# EAGLE design Backplane (EAGLE 9.6.2)
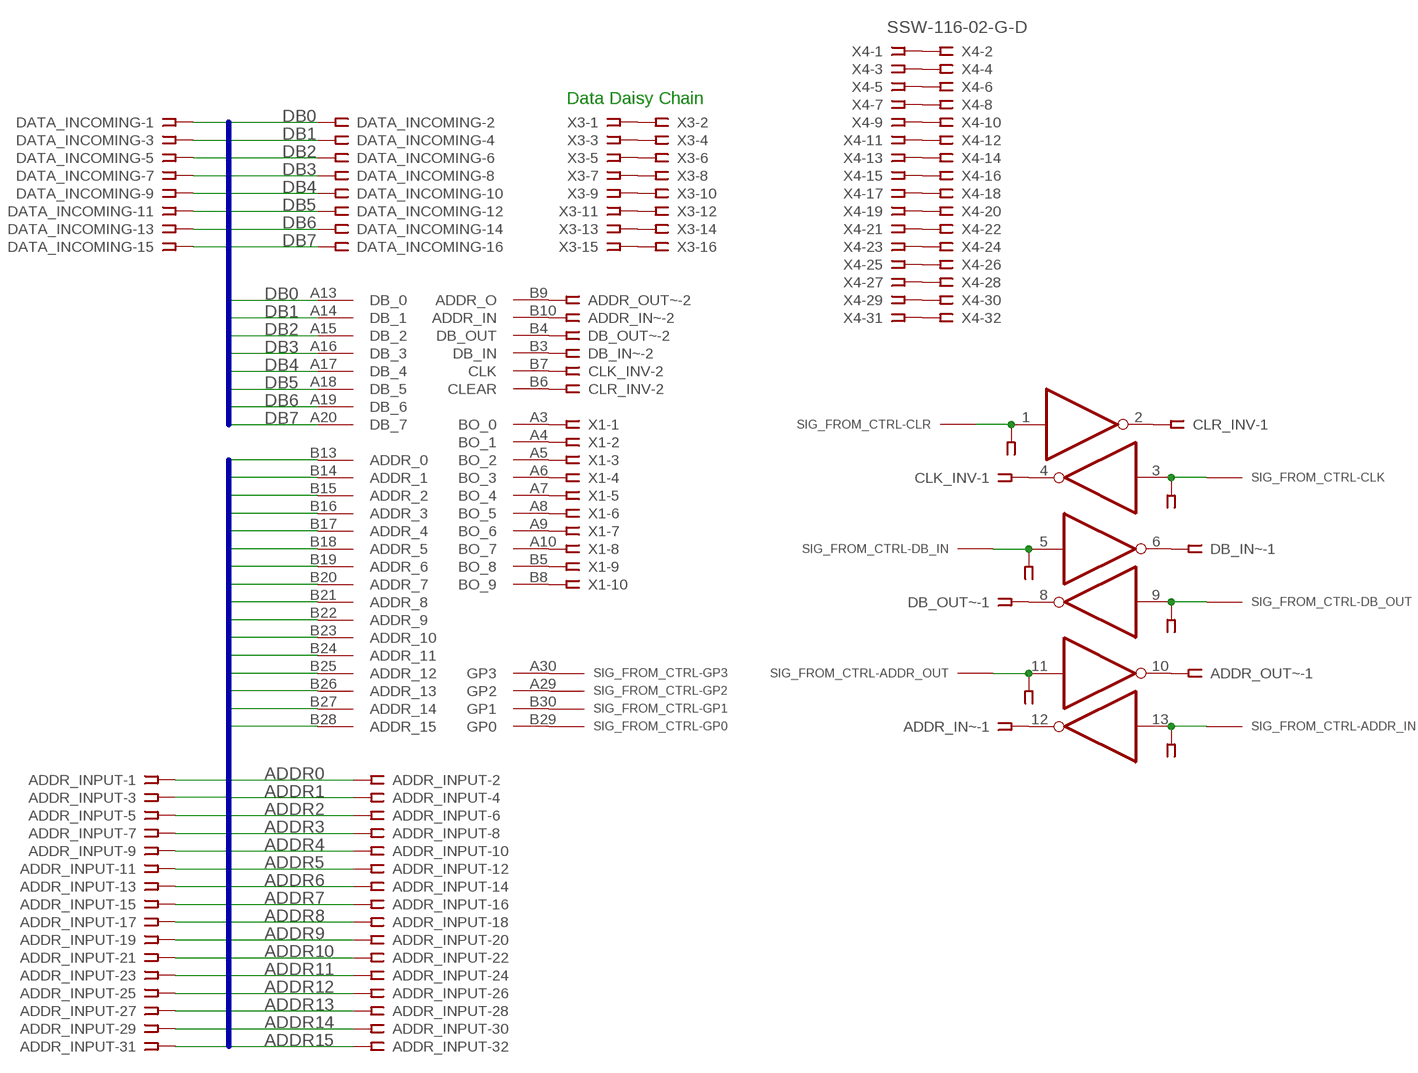
[diagram p0: schematic, sheet 1]

## Parts
ADDR_INPUT  SSW-116-02-G-D  [SSW-116-02-G-D]
ADDR_IN~  SSW-103-02-G-S  [SSW-103-02-G-S]
ADDR_OUT~  SSW-103-02-G-S  [SSW-103-02-G-S]
CLK_INV  SSW-103-02-G-S  [SSW-103-02-G-S]
CLR_INV  SSW-103-02-G-S  [SSW-103-02-G-S]
DATA_INCOMING  SSW-108-02-G-D  [SSW-108-02-G-D]
DB_IN~  SSW-103-02-G-S  [SSW-103-02-G-S]
DB_OUT~  SSW-103-02-G-S  [SSW-103-02-G-S]
IC1  74AC04N  [DIL14]
SIG_FROM_CTRL-  CONTROL_SIG-INT  [CONTROL_SIG-INT-FOOT]
U$2  BACKPLATE_INTERFACEHEADER  [PCI_INTERFACE]
X1  SSW-105-02-G-D  [SSW-105-02-G-D]
X3  SSW-108-02-G-D  [SSW-108-02-G-D]
X4  SSW-116-02-G-D  [SSW-116-02-G-D]

## Nets
ADDR0: ADDR_INPUT.1 ADDR_INPUT.2 U$2.B13(ADDR_0)
ADDR1: ADDR_INPUT.3 ADDR_INPUT.4 U$2.B14(ADDR_1)
ADDR2: ADDR_INPUT.5 ADDR_INPUT.6 U$2.B15(ADDR_2)
ADDR3: ADDR_INPUT.7 ADDR_INPUT.8 U$2.B16(ADDR_3)
ADDR4: ADDR_INPUT.9 ADDR_INPUT.10 U$2.B17(ADDR_4)
ADDR5: ADDR_INPUT.11 ADDR_INPUT.12 U$2.B18(ADDR_5)
ADDR6: ADDR_INPUT.13 ADDR_INPUT.14 U$2.B19(ADDR_6)
ADDR7: ADDR_INPUT.15 ADDR_INPUT.16 U$2.B20(ADDR_7)
ADDR8: ADDR_INPUT.17 ADDR_INPUT.18 U$2.B21(ADDR_8)
ADDR9: ADDR_INPUT.19 ADDR_INPUT.20 U$2.B22(ADDR_9)
ADDR10: ADDR_INPUT.21 ADDR_INPUT.22 U$2.B23(ADDR_10)
ADDR11: ADDR_INPUT.23 ADDR_INPUT.24 U$2.B24(ADDR_11)
ADDR12: ADDR_INPUT.25 ADDR_INPUT.26 U$2.B25(ADDR_12)
ADDR13: ADDR_INPUT.27 ADDR_INPUT.28 U$2.B26(ADDR_13)
ADDR14: ADDR_INPUT.29 ADDR_INPUT.30 U$2.B27(ADDR_14)
ADDR15: ADDR_INPUT.31 ADDR_INPUT.32 U$2.B28(ADDR_15)
DB0: DATA_INCOMING.1 DATA_INCOMING.2 U$2.A13(DB_0)
DB1: DATA_INCOMING.3 DATA_INCOMING.4 U$2.A14(DB_1)
DB2: DATA_INCOMING.5 DATA_INCOMING.6 U$2.A15(DB_2)
DB3: DATA_INCOMING.7 DATA_INCOMING.8 U$2.A16(DB_3)
DB4: DATA_INCOMING.9 DATA_INCOMING.10 U$2.A17(DB_4)
DB5: DATA_INCOMING.11 DATA_INCOMING.12 U$2.A18(DB_5)
DB6: DATA_INCOMING.13 DATA_INCOMING.14 U$2.A19(DB_6)
DB7: DATA_INCOMING.15 DATA_INCOMING.16 U$2.A20(DB_7)
N$1: CLR_INV.2 U$2.B6(CLEAR)
N$2: CLR_INV.3 IC1.1(A:I) SIG_FROM_CTRL-.CLR
N$3: CLK_INV.2 U$2.B7(CLK)
N$4: DB_IN~.2 U$2.B3(DB_IN)
N$5: DB_OUT~.2 U$2.B4(DB_OUT)
N$6: SIG_FROM_CTRL-.GP0 U$2.B29(GP0)
N$7: SIG_FROM_CTRL-.GP1 U$2.B30(GP1)
N$8: CLK_INV.3 IC1.3(B:I) SIG_FROM_CTRL-.CLK
N$9: DB_IN~.3 IC1.5(C:I) SIG_FROM_CTRL-.DB_IN
N$10: DB_OUT~.3 IC1.9(D:I) SIG_FROM_CTRL-.DB_OUT
N$11: SIG_FROM_CTRL-.GP2 U$2.A29(GP2)
N$12: SIG_FROM_CTRL-.GP3 U$2.A30(GP3)
N$13: ADDR_OUT~.3 IC1.11(E:I) SIG_FROM_CTRL-.ADDR_OT
N$14: ADDR_OUT~.1 IC1.10(E:O)
N$15: CLR_INV.1 IC1.2(A:O)
N$16: CLK_INV.1 IC1.4(B:O)
N$17: DB_IN~.1 IC1.6(C:O)
N$18: DB_OUT~.1 IC1.8(D:O)
N$19: ADDR_IN~.3 IC1.13(F:I) SIG_FROM_CTRL-.ADDR_IN
N$20: ADDR_IN~.1 IC1.12(F:O)
N$21: ADDR_OUT~.2 U$2.B9(ADDR_O)
N$22: ADDR_IN~.2 U$2.B10(ADDR_IN)
N$23: U$2.A3(BO_0) X1.1
N$24: U$2.A4(BO_1) X1.2
N$25: U$2.A5(BO_2) X1.3
N$26: U$2.A6(BO_3) X1.4
N$27: U$2.A7(BO_4) X1.5
N$28: U$2.A8(BO_5) X1.6
N$29: U$2.A9(BO_6) X1.7
N$30: U$2.A10(BO_7) X1.8
N$31: U$2.B5(BO_8) X1.9
N$32: U$2.B8(BO_9) X1.10
N$33: X3.1 X3.2
N$34: X3.3 X3.4
N$35: X3.5 X3.6
N$36: X3.7 X3.8
N$37: X3.9 X3.10
N$38: X3.11 X3.12
N$39: X3.13 X3.14
N$40: X3.15 X3.16
N$41: X4.1 X4.2
N$42: X4.3 X4.4
N$43: X4.5 X4.6
N$44: X4.7 X4.8
N$45: X4.9 X4.10
N$46: X4.11 X4.12
N$47: X4.13 X4.14
N$48: X4.15 X4.16
N$49: X4.17 X4.18
N$50: X4.19 X4.20
N$51: X4.21 X4.22
N$52: X4.23 X4.24
N$53: X4.25 X4.26
N$54: X4.27 X4.28
N$55: X4.29 X4.30
N$56: X4.31 X4.32
Unconnected: U$2.A1 U$2.A11 U$2.A12 U$2.A21 U$2.A22 U$2.A23 U$2.A24 U$2.A25 U$2.A26 U$2.A27 U$2.A28 U$2.A32 U$2.B1 U$2.B11 U$2.B12 U$2.B32

## Buses
DB[0..7]
ADDR[0..15]

## Notes on the sheet
- Data Daisy Chain

## Power pins joined to a net without a drawn wire
GND: IC1.7(P:GND) SIG_FROM_CTRL-.GND U$2.B2(GND) U$2.B31(GND)
VCC: IC1.14(P:VCC) SIG_FROM_CTRL-.VCC U$2.A2(VCC) U$2.A31(VCC)

## Library data of the parts
ADDR_INPUT X4 = con-samtec:SSW-116-02-G: THROUGH-HOLE .025" SQ POST SOCKET Source: Samtec SSW.pdf; MF: Samtec Inc.; MPN: SSW-116-02-G-D; OC_FARNELL: unknown; OC_NEWARK: 11P9577
ADDR_IN~ ADDR_OUT~ CLK_INV CLR_INV DB_IN~ DB_OUT~ = con-samtec:SSW-103-02-G-S: THROUGH-HOLE .025" SQ POST SOCKET Source: Samtec SSW.pdf; MF: Samtec Inc.; MPN: SSW-103-02-G-S; OC_FARNELL: unknown; OC_NEWARK: 11P9367
DATA_INCOMING X3 = con-samtec:SSW-108-02-G: THROUGH-HOLE .025" SQ POST SOCKET Source: Samtec SSW.pdf; MF: Samtec Inc.; MPN: SSW-108-02-G-D; OC_FARNELL: unknown; OC_NEWARK: 85K7646
IC1 = 74xx-eu:74*04: Hex INVERTER
SIG_FROM_CTRL- = Computer:CONTROL_SIG-INT
U$2 = Computer:BACKPLATE_INTERFACE
X1 = con-samtec:SSW-105-02-G: THROUGH-HOLE .025" SQ POST SOCKET Source: Samtec SSW.pdf; MF: Samtec Inc.; MPN: SSW-105-02-G-D; OC_FARNELL: unknown; OC_NEWARK: 11P9398

## Net classes
0 default: width 0.406 mm

## Board
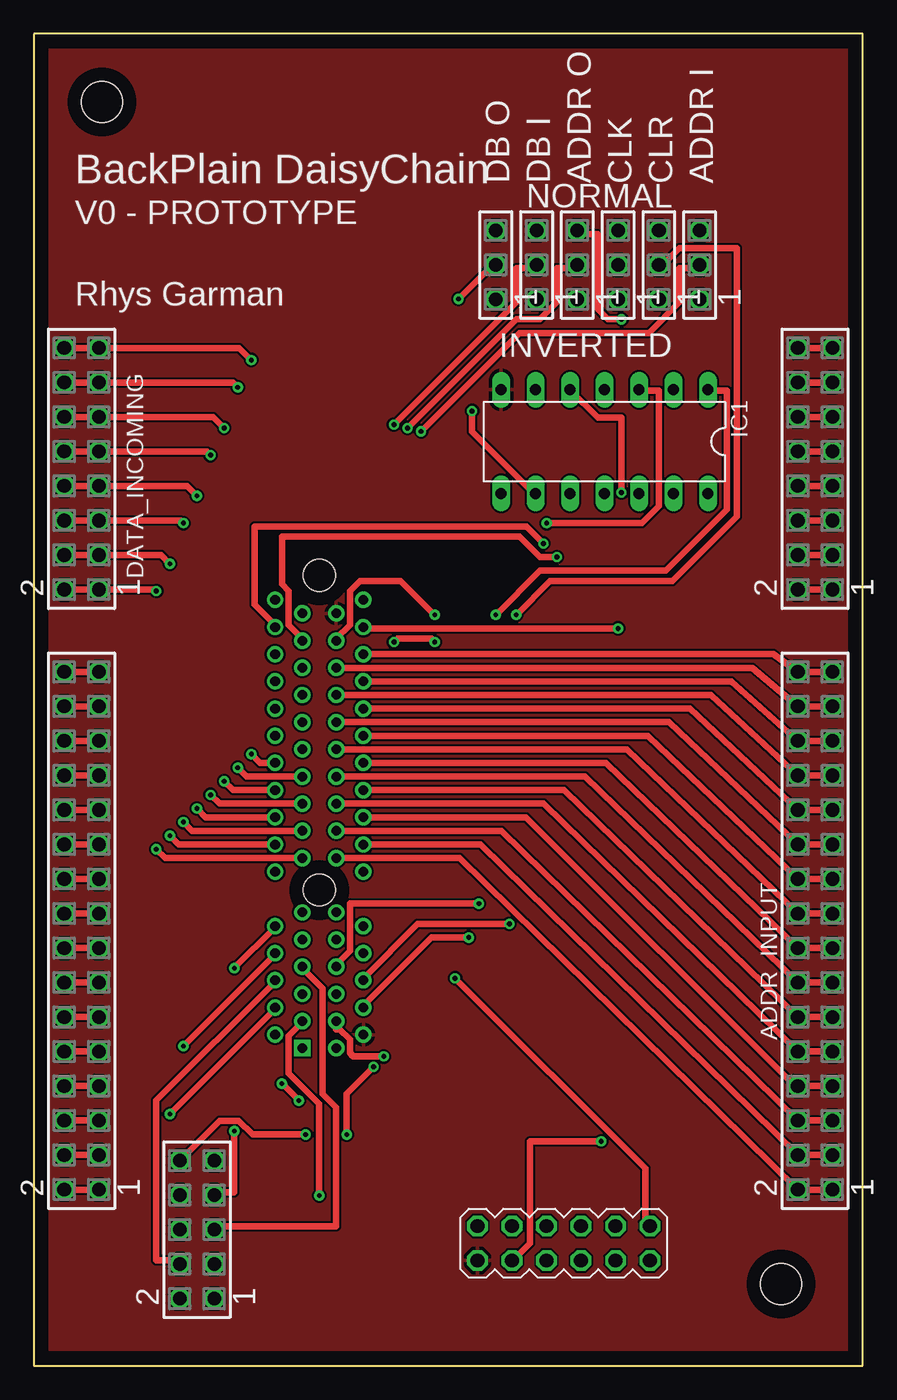
[diagram p1: board, top side]
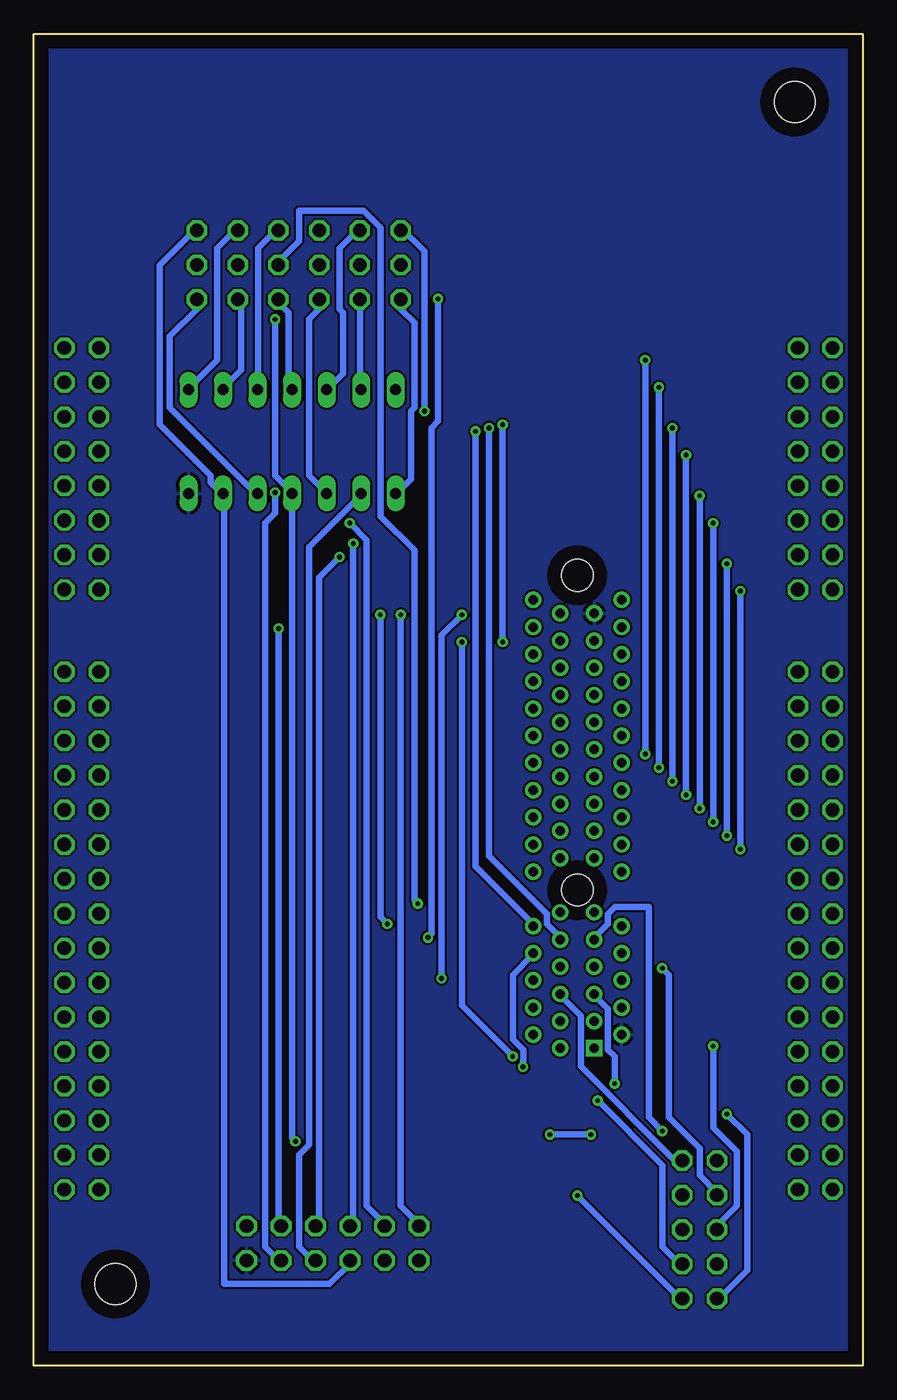
[diagram p2: board, bottom side, seen from below]

Size 61 x 98 mm. Coordinates in mm from the lower left corner, seen from the top.
Outline: 0,0 61,0 61,98 0,98 0,0
Copper layers (1*16): Top 0.035mm / dielectric 1.5mm / Bottom 0.035mm
Design rules "default *": minimum track width 19mil, minimum drill 0.35mm, track to track 6mil, track to pad 6mil, pad to pad 6mil, via to via 6mil, smd to smd 6mil, copper to edge 40mil, drill to drill 6mil, minimum pad ring 10mil, minimum via ring 8mil, stop-mask expansion 4mil, vias tented up to drill 0mil, thermal gap 10mil
Holes 3 mm at 5,93 55,6

### Footprints (pad centres in the part's own frame; a part is rotated, then mirrored left to right if it is on the bottom)
SSW-116-02-G-D = drill 1 pad 1.5 octagon: 1 -19.05,-1.27; 2 -19.05,1.27; 3 -16.51,-1.27; 4 -16.51,1.27; 5 -13.97,-1.27; 6 -13.97,1.27; 7 -11.43,-1.27; 8 -11.43,1.27; 9 -8.89,-1.27; 10 -8.89,1.27; 11 -6.35,-1.27; 12 -6.35,1.27; 13 -3.81,-1.27; 14 -3.81,1.27; 15 -1.27,-1.27; 16 -1.27,1.27; 17 1.27,-1.27; 18 1.27,1.27; 19 3.81,-1.27; 20 3.81,1.27; 21 6.35,-1.27; 22 6.35,1.27; 23 8.89,-1.27; 24 8.89,1.27; 25 11.43,-1.27; 26 11.43,1.27; 27 13.97,-1.27; 28 13.97,1.27; 29 16.51,-1.27; 30 16.51,1.27; 31 19.05,-1.27; 32 19.05,1.27
SSW-103-02-G-S = drill 1 pad 1.5 octagon: 1 -2.54,0; 2 0,0; 3 2.54,0
SSW-108-02-G-D = drill 1 pad 1.5 octagon: 1 -8.89,-1.27; 2 -8.89,1.27; 3 -6.35,-1.27; 4 -6.35,1.27; 5 -3.81,-1.27; 6 -3.81,1.27; 7 -1.27,-1.27; 8 -1.27,1.27; 9 1.27,-1.27; 10 1.27,1.27; 11 3.81,-1.27; 12 3.81,1.27; 13 6.35,-1.27; 14 6.35,1.27; 15 8.89,-1.27; 16 8.89,1.27
DIL14 = drill 0.813 long: 1 -7.62,-3.81; 2 -5.08,-3.81; 3 -2.54,-3.81; 4 0,-3.81; 5 2.54,-3.81; 6 5.08,-3.81; 7 7.62,-3.81; 8 7.62,3.81; 9 5.08,3.81; 10 2.54,3.81; 11 0,3.81; 12 -2.54,3.81; 13 -5.08,3.81; 14 -7.62,3.81
CONTROL_SIG-INT-FOOT = drill 1.016 octagon: ADDR_IN 1.27,1.27; ADDR_OT 3.81,1.27; CLK 3.81,-1.27; CLR 6.35,-1.27; DB_IN -3.81,1.27; DB_OUT -1.27,1.27; GND 6.35,1.27; GP0 -6.35,-1.27; GP1 -3.81,-1.27; GP2 -1.27,-1.27; GP3 1.27,-1.27; VCC -6.35,1.27
PCI_INTERFACE = drill 0.7 square: A1 -11.65,1.25 | drill 0.7: A2 -10.65,3.25; A3 -9.65,1.25; A4 -8.65,3.25; A5 -7.65,1.25; A6 -6.65,3.25; A7 -5.65,1.25; A8 -4.65,3.25; A9 -3.65,1.25; A10 -2.65,3.25; A11 -1.65,1.25; A12 1.35,3.25; A13 2.35,1.25; A14 3.35,3.25; A15 4.35,1.25; A16 5.35,3.25; A17 6.35,1.25; A18 7.35,3.25; A19 8.35,1.25; A20 9.35,3.25; A21 10.35,1.25; A22 11.35,3.25; A23 12.35,1.25; A24 13.35,3.25; A25 14.35,1.25; A26 15.35,3.25; A27 16.35,1.25; A28 17.35,3.25; A29 18.35,1.25; A30 19.35,3.25; A31 20.35,1.25; A32 21.35,3.25; B1 -11.65,-1.25; B2 -10.65,-3.25; B3 -9.65,-1.25; B4 -8.65,-3.25; B5 -7.65,-1.25; B6 -6.65,-3.25; B7 -5.65,-1.25; B8 -4.65,-3.25; B9 -3.65,-1.25; B10 -2.65,-3.25; B11 -1.65,-1.25; B12 1.35,-3.25; B13 2.35,-1.25; B14 3.35,-3.25; B15 4.35,-1.25; B16 5.35,-3.25; B17 6.35,-1.25; B18 7.35,-3.25; B19 8.35,-1.25; B20 9.35,-3.25; B21 10.35,-1.25; B22 11.35,-3.25; B23 12.35,-1.25; B24 13.35,-3.25; B25 14.35,-1.25; B26 15.35,-3.25; B27 16.35,-1.25; B28 17.35,-3.25; B29 18.35,-1.25; B30 19.35,-3.25; B31 20.35,-1.25; B32 21.35,-3.25 | hole 2.35: 0,0; 23.15,0
SSW-105-02-G-D = drill 1 pad 1.5 octagon: 1 -5.08,-1.27; 2 -5.08,1.27; 3 -2.54,-1.27; 4 -2.54,1.27; 5 0,-1.27; 6 0,1.27; 7 2.54,-1.27; 8 2.54,1.27; 9 5.08,-1.27; 10 5.08,1.27

### Placement (x,y rotation side)
ADDR_INPUT  57.5,32 90 top
ADDR_IN~  49,81 90 top
ADDR_OUT~  40,81 90 top
CLK_INV  43,81 90 top
CLR_INV  46,81 90 top
DATA_INCOMING  3.5,66 90 top
DB_IN~  37,81 90 top
DB_OUT~  34,81 90 top
IC1  42,68 180 top
SIG_FROM_CTRL-  39,9 180 top
U$2  21,35 90 top
X1  12,10 90 top
X3  57.5,66 90 top
X4  3.5,32 90 top

### Tracks (layer width: path | path; a pad name or v marks a point on that pad's centre or on a via)
ADDR0
  Top 0.483: ADDR_INPUT.1 ADDR_INPUT.2 31.33,37.35 U$2.B13
ADDR1
  Top 0.483: ADDR_INPUT.3 ADDR_INPUT.4 32.87,38.35 U$2.B14
ADDR2
  Top 0.483: ADDR_INPUT.5 ADDR_INPUT.6 34.41,39.35 U$2.B15
ADDR3
  Top 0.483: ADDR_INPUT.7 ADDR_INPUT.8 56,20.57 36.22,40.35 U$2.B16
ADDR4
  Top 0.483: ADDR_INPUT.9 ADDR_INPUT.10 37.49,41.35 U$2.B17
ADDR5
  Top 0.483: ADDR_INPUT.11 ADDR_INPUT.12 39.03,42.35 U$2.B18
ADDR6
  Top 0.483: ADDR_INPUT.13 ADDR_INPUT.14 40.57,43.35 U$2.B19
ADDR7
  Top 0.483: ADDR_INPUT.15 ADDR_INPUT.16 42.11,44.35 U$2.B20
ADDR8
  Top 0.483: ADDR_INPUT.17 ADDR_INPUT.18 43.65,45.35 U$2.B21
ADDR9
  Top 0.483: ADDR_INPUT.19 ADDR_INPUT.20 45.19,46.35 U$2.B22
ADDR10
  Top 0.483: ADDR_INPUT.21 ADDR_INPUT.22 46.73,47.35 U$2.B23
ADDR11
  Top 0.483: ADDR_INPUT.23 ADDR_INPUT.24 48.27,48.35 U$2.B24
ADDR12
  Top 0.483: ADDR_INPUT.25 ADDR_INPUT.26 49.81,49.35 U$2.B25
ADDR13
  Top 0.483: ADDR_INPUT.27 ADDR_INPUT.28 51.35,50.35 U$2.B26
ADDR14
  Top 0.483: ADDR_INPUT.29 ADDR_INPUT.30 52.89,51.35 U$2.B27
ADDR15
  Top 0.483: ADDR_INPUT.31 ADDR_INPUT.32 54.43,52.35 U$2.B28
DB0  (via drill 0.35)
  Top 0.483: DATA_INCOMING.2 DATA_INCOMING.1 8.89,57.11 v9,57 | U$2.A13 9.65,37.35 v9,38
  Bottom 0.483: v9,38 v9,57
DB1  (via drill 0.35)
  Top 0.483: DATA_INCOMING.4 DATA_INCOMING.3 9.35,59.65 v10,59 | U$2.A14 10.65,38.35 v10,39
  Bottom 0.483: v10,39 v10,59
DB2  (via drill 0.35)
  Top 0.483: DATA_INCOMING.6 DATA_INCOMING.5 10.81,62.19 v11,62 | U$2.A15 11.65,39.35 v11,40
  Bottom 0.483: v11,40 v11,62
DB3  (via drill 0.35)
  Top 0.483: DATA_INCOMING.8 DATA_INCOMING.7 11.27,64.73 v12,64 | U$2.A16 12.65,40.35 v12,41
  Bottom 0.483: v12,41 v12,64
DB4  (via drill 0.35)
  Top 0.483: DATA_INCOMING.10 DATA_INCOMING.9 12.73,67.27 v13,67 | U$2.A17 13.65,41.35 v13,42
  Bottom 0.483: v13,42 v13,67
DB5  (via drill 0.35)
  Top 0.483: DATA_INCOMING.12 DATA_INCOMING.11 13.19,69.81 v14,69 | U$2.A18 14.65,42.35 v14,43
  Bottom 0.483: v14,43 v14,69
DB6  (via drill 0.35)
  Top 0.483: DATA_INCOMING.14 DATA_INCOMING.13 14.65,72.35 v15,72 | U$2.A19 15.65,43.35 v15,44
  Bottom 0.483: v15,44 v15,72
DB7  (via drill 0.35)
  Top 0.483: DATA_INCOMING.16 DATA_INCOMING.15 15.11,74.89 v16,74 | U$2.A20 16.65,44.35 v16,45
  Bottom 0.483: v16,45 v16,74
GND
  pour Top: 0,98 61,98 61,0 0,0
N$1  (via drill 0.35)
  Top 0.483: v35,32.5 28.25,32.5 24.25,28.5 U$2.B6 | v35.5,55.25 38,57.75 47,57.75 51.75,62.5 51.75,82.25 47.5,82.25 46.25,81 CLR_INV.2
  Bottom 0.483: v35,32.5 35.5,33 v35.5,55.25
N$2  (via drill 0.35)
  Top 0.483: v34,55.25 37.25,58.5 46.5,58.5 51,63 51,71.75 49.75,71.75 IC1.1
  Bottom 0.483: IC1.1 49.5,72 47.5,74 47.5,82.25 46,83.75 CLR_INV.3 | v34,55.25 34,11.75 32.75,10.5 SIG_FROM_CTRL-.CLR
N$3  (via drill 0.35)
  Top 0.483: v32.75,34 23.25,34 23.25,30.5 22.25,29.5 U$2.B7
  Bottom 0.483: v32.75,34 33,34.25 33,60 35.5,62.5 35.5,83.75 36.75,85 41.5,85 41.5,82.75 43,81.25 CLK_INV.2
N$4  (via drill 0.35)
  Top 0.483: U$2.B3 22.25,24.75 22.5,24.75 23.25,24 23.25,23 23.5,22.75 v25.75,22.75 | v29.5,53.25 29.25,53.5 26.75,53.5 v26.5,53.25 | v26.5,69.25 35.5,78.25 35.5,80.75 36.25,80.75 36.5,81 DB_IN~.2
  Bottom 0.483: v25.75,22.75 29.5,26.5 v29.5,53.25 | v26.5,69.25 v26.5,53.25
N$5  (via drill 0.35)
  Top 0.483: v32,31.5 29.25,31.5 24.25,26.5 U$2.B4 | v31.25,78.5 33.75,81 DB_OUT~.2
  Bottom 0.483: v32,31.5 31.75,31.75 31.75,69 31.25,69.5 v31.25,78.5
N$6  (via drill 0.35)
  Top 0.483: v29.5,55.25 27,57.75 24,57.75 23.25,57 23.25,54.5 22.25,53.5 U$2.B29 | v31,28.5 45,14.5 45,10.5 45.25,10.5 SIG_FROM_CTRL-.GP0
  Bottom 0.483: v29.5,55.25 31,53.75 v31,28.5
N$7  (via drill 0.35)
  Top 0.483: v43,54.25 24.25,54.25 U$2.B30
  Bottom 0.483: v43,54.25 43,10.5 SIG_FROM_CTRL-.GP1
N$8  (via drill 0.35)
  Top 0.483: v37.75,62 44.75,62 46,63.25 46,71.75 44.75,71.75 IC1.3
  Bottom 0.483: IC1.3 44.5,72 44.5,82.25 43,83.75 CLK_INV.3 | v37.75,62 36.5,60.75 36.5,11.75 35.25,10.5 SIG_FROM_CTRL-.CLK
N$9  (via drill 0.35)
  Top 0.483: v43.25,64.25 43.25,69.75 41.5,69.75 39.5,71.75 IC1.5
  Bottom 0.483: IC1.5 39.25,72 38.25,73 38.25,77.5 38.5,77.75 38.5,82.25 37,83.75 DB_IN~.3 | v43.25,64.25 43.25,62.75 44,62 44,8.75 43,7.75 SIG_FROM_CTRL-.DB_IN
N$10  (via drill 0.35)
  Top 0.483: v32.25,70.25 32.25,68.75 36.75,64.25 IC1.9
  Bottom 0.483: v32.25,70.25 32.25,82 34,83.75 DB_OUT~.3 | SIG_FROM_CTRL-.DB_OUT 40.5,7.75 41.5,8.75 41.5,15.5 40.75,16.25 40.75,60.25 37,64 IC1.9
N$11  (via drill 0.35)
  Top 0.483: v38.5,59.5 37.25,59.5 35.75,61 18.25,61 18.25,57.5 18.75,57 18.75,54.5 19.75,53.5 U$2.A29
  Bottom 0.483: v38.5,59.5 40,58 40,11 40.25,10.75 40.25,10.5 SIG_FROM_CTRL-.GP2
N$12  (via drill 0.35)
  Top 0.483: v37.5,60.5 36.25,61.75 16.25,61.75 16.25,56 17.75,54.5 U$2.A30
  Bottom 0.483: v37.5,60.5 37.5,10.5 SIG_FROM_CTRL-.GP3
N$13  (via drill 0.35)
  Top 0.483: v43.25,77 42.25,77 41.5,77.75 41.5,83.25 40.75,83.25 40.5,83.5 40,83.5 ADDR_OUT~.3 | v41.75,16.5 36.5,16.5 36.5,9 35.25,7.75 SIG_FROM_CTRL-.ADDR_OT
  Bottom 0.483: v43.25,77 43.25,65.5 42,64.25 IC1.11 42,16.75 v41.75,16.5
N$14
  Bottom 0.483: ADDR_OUT~.1 40,77.75 40.75,77 40.75,65.5 39.5,64.25 IC1.10
N$15
  Bottom 0.483: IC1.2 47,72 45.75,73.25 45.75,78 46,78.25 CLR_INV.1
N$16
  Bottom 0.483: IC1.4 42,72 42.25,72.25 42.25,77.5 43,78.25 CLK_INV.1
N$17
  Bottom 0.483: DB_IN~.1 37,72 IC1.6
N$18
  Bottom 0.483: DB_OUT~.1 34,77.75 33,76.75 33,70.5 33.25,70.25 33.25,65.25 34.25,64.25 IC1.8
N$19
  Bottom 0.483: ADDR_IN~.3 49,83.75 51.75,81 51.75,69.25 48,65.5 48,65 47.25,64.25 IC1.13 47,64 47,6 39.25,6 37.75,7.5 SIG_FROM_CTRL-.ADDR_IN
N$20
  Bottom 0.483: ADDR_IN~.1 49,77.75 51,75.75 51,70.5 44.75,64.25 IC1.12
N$21  (via drill 0.35)
  Top 0.483: v27.5,69 35.5,77 37.25,77 38.5,78.25 38.5,80.75 39.25,80.75 39.5,81 ADDR_OUT~.2
  Bottom 0.483: v27.5,69 27.5,37.5 23.25,33.25 23.25,32.5 22.25,31.5 U$2.B9
N$22  (via drill 0.35)
  Top 0.483: v28.5,68.75 35.75,76 45.25,76 47.5,78.25 47.5,80.75 48.25,80.75 48.5,81 ADDR_IN~.2
  Bottom 0.483: v28.5,68.75 28.5,36.75 24.25,32.5 U$2.B10
N$23  (via drill 0.35)
  Top 0.483: v21,12.5 21,19.25 18.75,21.5 18.75,24.25 19.75,25.25 U$2.A3
  Bottom 0.483: v21,12.5 13.5,5 X1.1
N$24  (via drill 0.35)
  Top 0.483: v10,18.5 17.75,26.25 U$2.A4
  Bottom 0.483: v10,18.5 8.5,17 8.5,7 10.5,5 X1.2
N$25  (via drill 0.35)
  Top 0.483: v19.5,19.5 v18.25,20.75
  Bottom 0.483: v18.25,20.75 18.25,22.75 18.75,23.25 18.75,26.25 19.75,27.25 U$2.A5 | v19.5,19.5 14.75,14.75 14.75,8.75 13.5,7.5 X1.3
N$26
  Top 0.483: U$2.A6 17.75,28.25 9,19.5 9,7.75 10,7.75 10.25,7.5 10.5,7.5 X1.4
N$27
  Top 0.483: X1.5 13.75,10 14,10.25 22.25,10.25 22.25,19 21.25,20 21.25,27.75 19.75,29.25 U$2.A7
N$28  (via drill 0.35)
  Top 0.483: v11,23.5 17.75,30.25 U$2.A8
  Bottom 0.483: v11,23.5 11,17.5 9.25,15.75 9.25,11.75 10.5,10.5 10.5,10 X1.6
N$29  (via drill 0.35)
  Top 0.483: v14.75,17.25 14.75,12.75 13.5,12.75 X1.7
  Bottom 0.483: v14.75,17.25 15.75,18.25 15.75,33.75 18.25,33.75 18.75,33.25 18.75,32.5 19.75,31.5 U$2.A9
N$30  (via drill 0.35)
  Top 0.483: v14.75,29.25 17.75,32.25 U$2.A10
  Bottom 0.483: v14.75,29.25 14.25,28.75 14.25,18.25 12,16 12,14 10.75,12.75 X1.8
N$31
  Bottom 0.483: U$2.B5 22.25,27.25 20.75,25.75 20.75,22 14,15.25 13.5,15.25 X1.9
N$32  (via drill 0.35)
  Top 0.483: v20,17 16.09,17 15.07,18.02 13.67,18.02 X1.10 | v23.02,17 23.02,20 v25,21.98
  Bottom 0.483: U$2.B8 24.25,30.25 25.75,28.75 25.75,24 24.98,23.23 24.98,22.43 25,22.41 v25,21.98 | v20,17 v23.02,17
N$33
  Top 0.483: X3.1 X3.2
N$34
  Top 0.483: X3.4 X3.3
N$35
  Top 0.483: X3.5 X3.6
N$36
  Top 0.483: X3.8 X3.7
N$37
  Top 0.483: X3.10 X3.9
N$38
  Top 0.483: X3.12 X3.11
N$39
  Top 0.483: X3.14 X3.13
N$40
  Top 0.483: X3.16 X3.15
N$41
  Top 0.483: X4.2 X4.1
N$42
  Top 0.483: X4.3 X4.4
N$43
  Top 0.483: X4.6 X4.5
N$44
  Top 0.483: X4.7 X4.8
N$45
  Top 0.483: X4.10 X4.9
N$46
  Top 0.483: X4.11 X4.12
N$47
  Top 0.483: X4.14 X4.13
N$48
  Top 0.483: X4.15 X4.16
N$49
  Top 0.483: X4.18 X4.17
N$50
  Top 0.483: X4.19 X4.20
N$51
  Top 0.483: X4.22 X4.21
N$52
  Top 0.483: X4.23 X4.24
N$53
  Top 0.483: X4.26 X4.25
N$54
  Top 0.483: X4.27 X4.28
N$55
  Top 0.483: X4.30 X4.29
N$56
  Top 0.483: X4.31 X4.32
VCC
  pour Bottom: 0,98 61,98 61,0 0,0

### Text on the board
tNames: BackPlain DaisyChain | DB O | DB I | ADDR O | CLK | CLR | NORMAL | ADDR I | V0 - PROTOTYPE | Rhys Garman | INVERTED